# EAGLE design L293D MOTOR SÜRÜCÜ (EAGLE 9.6.2)
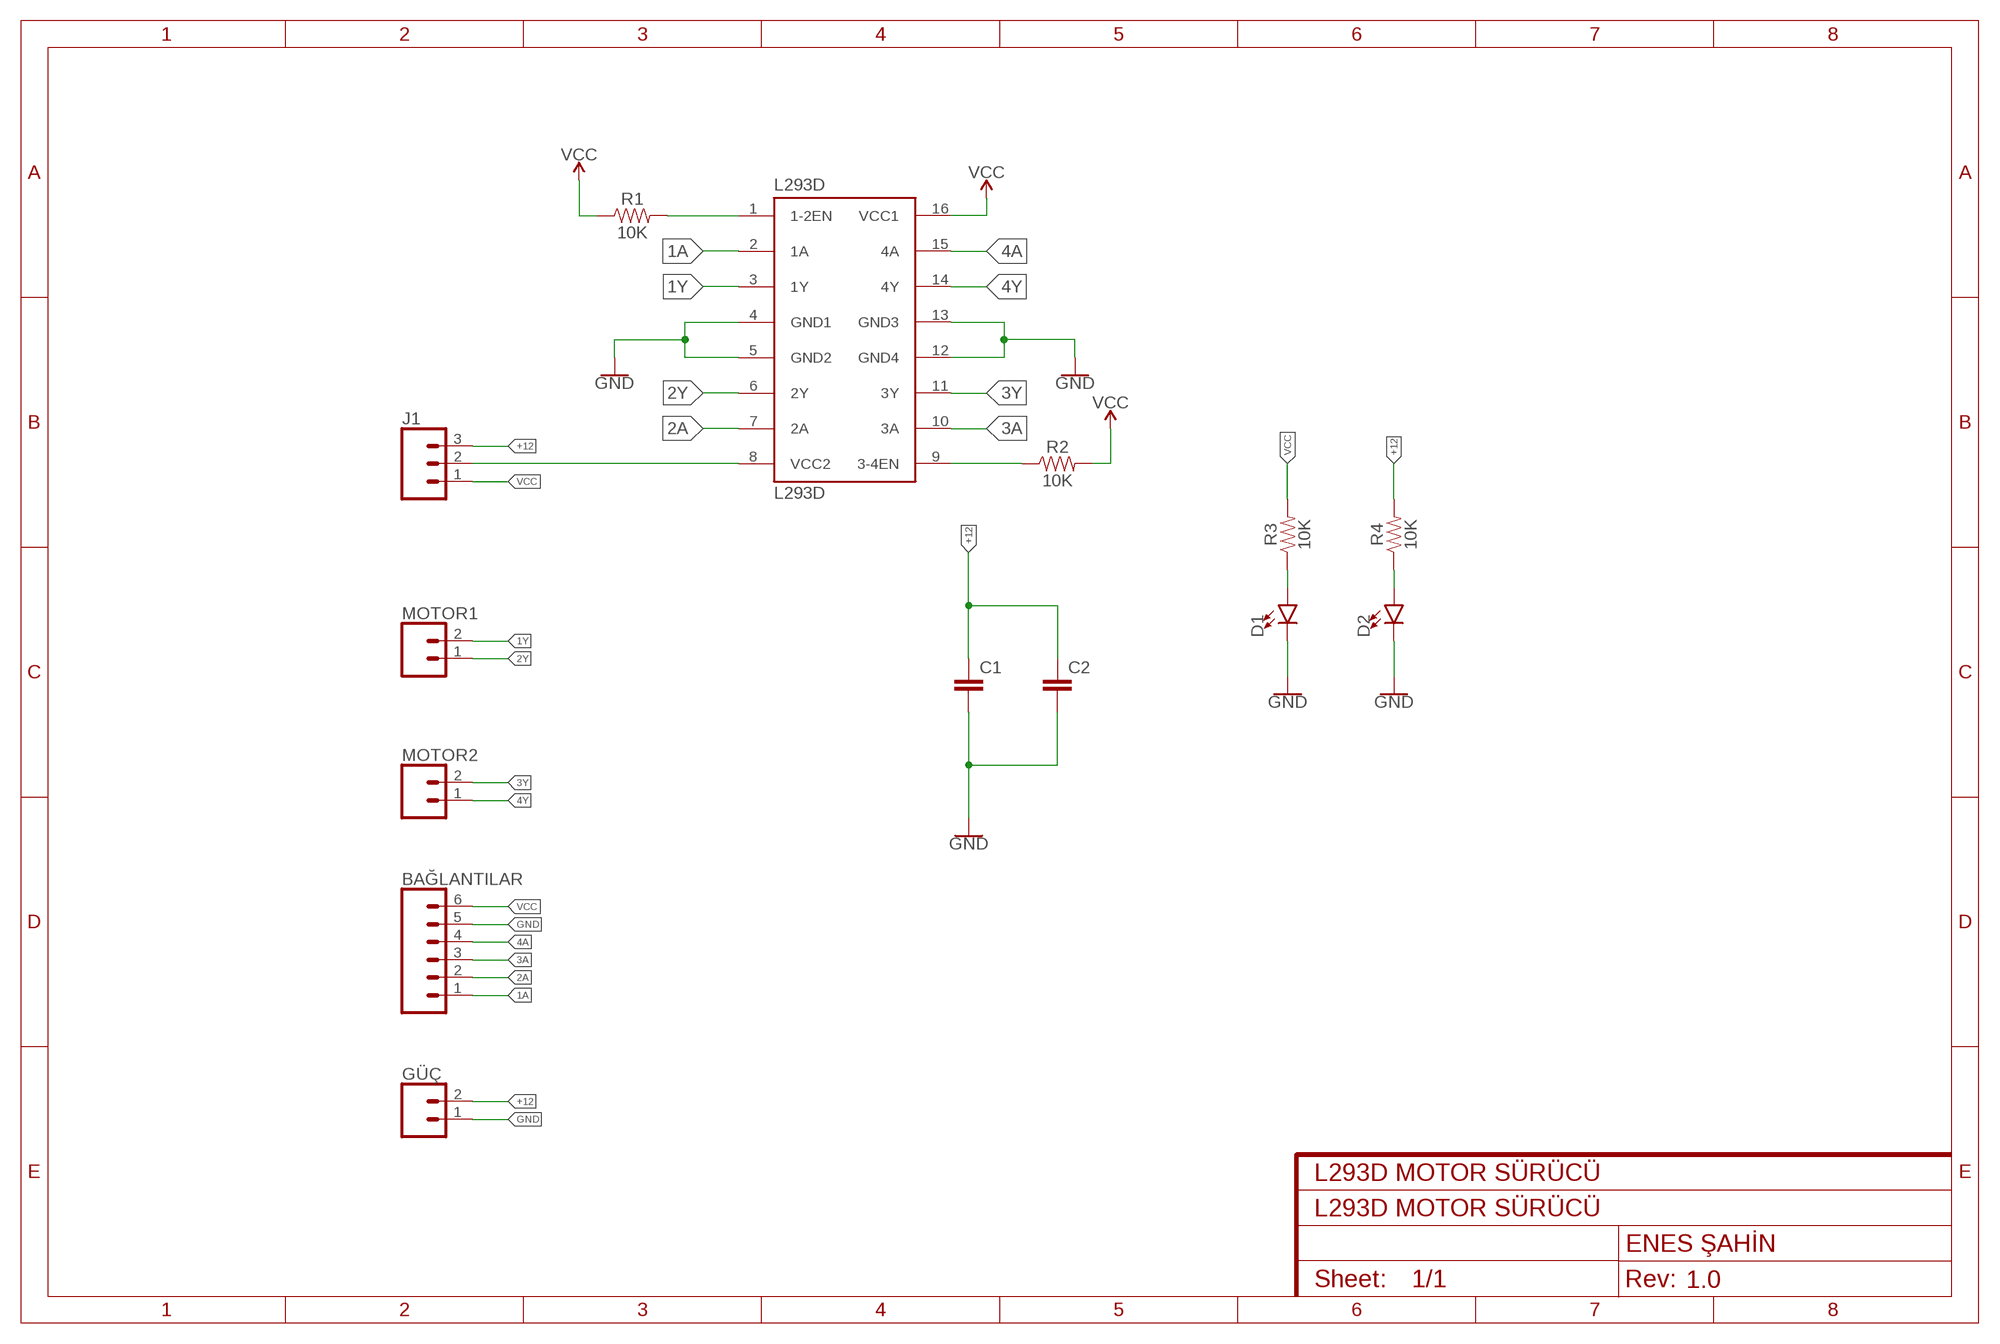
[diagram p0: schematic, sheet 1]
FRAME1 (FRAME-A4L): CNAME: L293D MOTOR SÜRÜCÜ; CREVISION: 1.0; DESIGNER: ENES ŞAHİN

## Parts
BAĞLANTILAR  CONN_06LOCK  [1X06_LOCK]
C1  C2,5-3  [C2.5-3]
C2  C2,5-3  [C2.5-3]
D1  LED-3MM-NO_SILK  [LED_3MM-NS]
D2  LED-3MM-NO_SILK  [LED_3MM-NS]
GÜÇ  CONN_02  [1X02]
J1  CONN_03  [1X03]
L293D  L293D  [DIL16]
MOTOR1  CONN_02  [1X02]
MOTOR2  CONN_02  [1X02]
R1  10K  1KOHM-HORIZ-1/4W-1%  [AXIAL-0.3]
R2  10K  1KOHM-HORIZ-1/4W-1%  [AXIAL-0.3]
R3  10K  1KOHM-HORIZ-1/4W-1%  [AXIAL-0.3]
R4  10K  1KOHM-HORIZ-1/4W-1%  [AXIAL-0.3]

## Nets
1A: BAĞLANTILAR.1 L293D.2(1A)
1Y: L293D.3(1Y) MOTOR1.2
2A: BAĞLANTILAR.2 L293D.7(2A)
2Y: L293D.6(2Y) MOTOR1.1
3A: BAĞLANTILAR.3 L293D.10(3A)
3Y: L293D.11(3Y) MOTOR2.2
4A: BAĞLANTILAR.4 L293D.15(4A)
4Y: L293D.14(4Y) MOTOR2.1
+12: C1.1 C2.1 GÜÇ.2 J1.3 R4.P$2
GND: BAĞLANTILAR.5 C1.2 C2.2 D1.K(C) D2.K(C) GÜÇ.1 L293D.4(GND1) L293D.5(GND2) L293D.12(GND4) L293D.13(GND3)
N$1: J1.2 L293D.8(VCC2)
N$2: D2.A R4.P$1
N$3: L293D.1(1-2EN) R1.P$2
N$4: L293D.9(3-4EN) R2.P$1
N$5: D1.A R3.P$1
VCC: BAĞLANTILAR.6 J1.1 L293D.16(VCC1) R1.P$1 R2.P$2 R3.P$2

## Library data of the parts
BAĞLANTILAR = SparkFun-Connectors:CONN_06: Multi connection point. Often used as Generic Header-pin footprint for 0.1 inch spaced/style header connections On any of the 0.1 inch spaced packages, you can populate with these: Break Away Headers - Straight <https://www.sparkfun.com/products/116> (PRT-00116) Break Away Male Headers - Right Angle <https://www.sparkfun.com/products/553> (PRT-00553) Female Headers <https://www.sparkfun.com/products/115> (PRT-00115) Break Away Headers - Machine Pin <https://www.sparkfun.com/products/117> (PRT-00117) Break Away Female Headers - Swiss Machine Pin <https://www.sparkfun.com/products/743> (PRT-00743) Arduino Stackable Header - 6 Pin <https://www.sparkfun.com/products/9280> (PRT-09280) For SCREWTERMINALS and SPRING TERMINALS visit here: Screw Terimnals on SparkFun.com <https://www.sparkfun.com/search/results?term=Screw+Terminals> (5mm/3.5mm/2.54mm spacing) This device is also useful as a general connection point to wire up your design to another part of your project. Our various solder wires solder well into these plated through hole pads. Hook-Up Wire - Assortment (Stranded, 22 AWG) <https://www.sparkfun.com/products/11375> (PRT-11375) Hook-Up Wire - Assortment (Solid Core, 22 AWG) <https://www.sparkfun.com/products/11367> (PRT-11367) View the entire wire category on our website here <https://www.sparkfun.com/categories/141>
C1 C2 = capacitor-wima:C: CAPACITOR naming: grid - package width
D1 D2 = SparkFun-LED1:LED: LED (Generic) Standard schematic elements and footprints for 5mm, 3mm, 1206, and 0603 sized LEDs. Generic LEDs with no color specified.
GÜÇ MOTOR1 MOTOR2 = SparkFun-Connectors:CONN_02: Multi connection point. Often used as Generic Header-pin footprint for 0.1 inch spaced/style header connections On any of the 0.1 inch spaced packages, you can populate with these: Break Away Headers - Straight <https://www.sparkfun.com/products/116> (PRT-00116) Break Away Male Headers - Right Angle <https://www.sparkfun.com/products/553> (PRT-00553) Female Headers <https://www.sparkfun.com/products/115> (PRT-00115) Break Away Headers - Machine Pin <https://www.sparkfun.com/products/117> (PRT-00117) Break Away Female Headers - Swiss Machine Pin <https://www.sparkfun.com/products/743> (PRT-00743) For SCREWTERMINALS and SPRING TERMINALS visit here: Screw Terimnals on SparkFun.com <https://www.sparkfun.com/search/results?term=Screw+Terminals> (5mm/3.5mm/2.54mm spacing) This device is also useful as a general connection point to wire up your design to another part of your project. Our various solder wires solder well into these plated through hole pads. Hook-Up Wire - Assortment (Stranded, 22 AWG) <https://www.sparkfun.com/products/11375> (PRT-11375) Hook-Up Wire - Assortment (Solid Core, 22 AWG) <https://www.sparkfun.com/products/11367> (PRT-11367) View the entire wire category on our website here <https://www.sparkfun.com/categories/141> Special notes: Molex polarized connector foot print use with: PRT-08233 with associated crimp pins and housings. 2.54_SCREWTERM for use with PRT-10571. 3.5mm Screw Terminal footprints for PRT-08084 5mm Screw Terminal footprints for use with PRT-08432
J1 = SparkFun-Connectors:CONN_03: Multi connection point. Often used as Generic Header-pin footprint for 0.1 inch spaced/style header connections On any of the 0.1 inch spaced packages, you can populate with these: Break Away Headers - Straight <https://www.sparkfun.com/products/116> (PRT-00116) Break Away Male Headers - Right Angle <https://www.sparkfun.com/products/553> (PRT-00553) Female Headers <https://www.sparkfun.com/products/115> (PRT-00115) Break Away Headers - Machine Pin <https://www.sparkfun.com/products/117> (PRT-00117) Break Away Female Headers - Swiss Machine Pin <https://www.sparkfun.com/products/743> (PRT-00743) Stackable Header - 3 Pin (Female, 0.1") <https://www.sparkfun.com/products/13875> (PRT-13875) For SCREWTERMINALS and SPRING TERMINALS visit here: Screw Terimnals on SparkFun.com <https://www.sparkfun.com/search/results?term=Screw+Terminals> (5mm/3.5mm/2.54mm spacing) This device is also useful as a general connection point to wire up your design to another part of your project. Our various solder wires solder well into these plated through hole pads. Hook-Up Wire - Assortment (Stranded, 22 AWG) <https://www.sparkfun.com/products/11375> (PRT-11375) Hook-Up Wire - Assortment (Solid Core, 22 AWG) <https://www.sparkfun.com/products/11367> (PRT-11367) View the entire wire category on our website here <https://www.sparkfun.com/categories/141> Special notes: Molex polarized connector foot print use with SKU : PRT-08232 with associated crimp pins and housings.
L293D = st-microelectronics:L293D: PUSH-PULL 4 CHANNEL DRIVER; MPN: L293D; OC_FARNELL: 9589619; OC_NEWARK: 56P8249
R1-R4 = SparkFun-Resistors:1KOHM: 1kΩ resistor A resistor is a passive two-terminal electrical component that implements electrical resistance as a circuit element. Resistors act to reduce current flow, and, at the same time, act to lower voltage levels within circuits. - Wikipedia; PROD_ID: RES-12182; VALUE: 1k

## Board
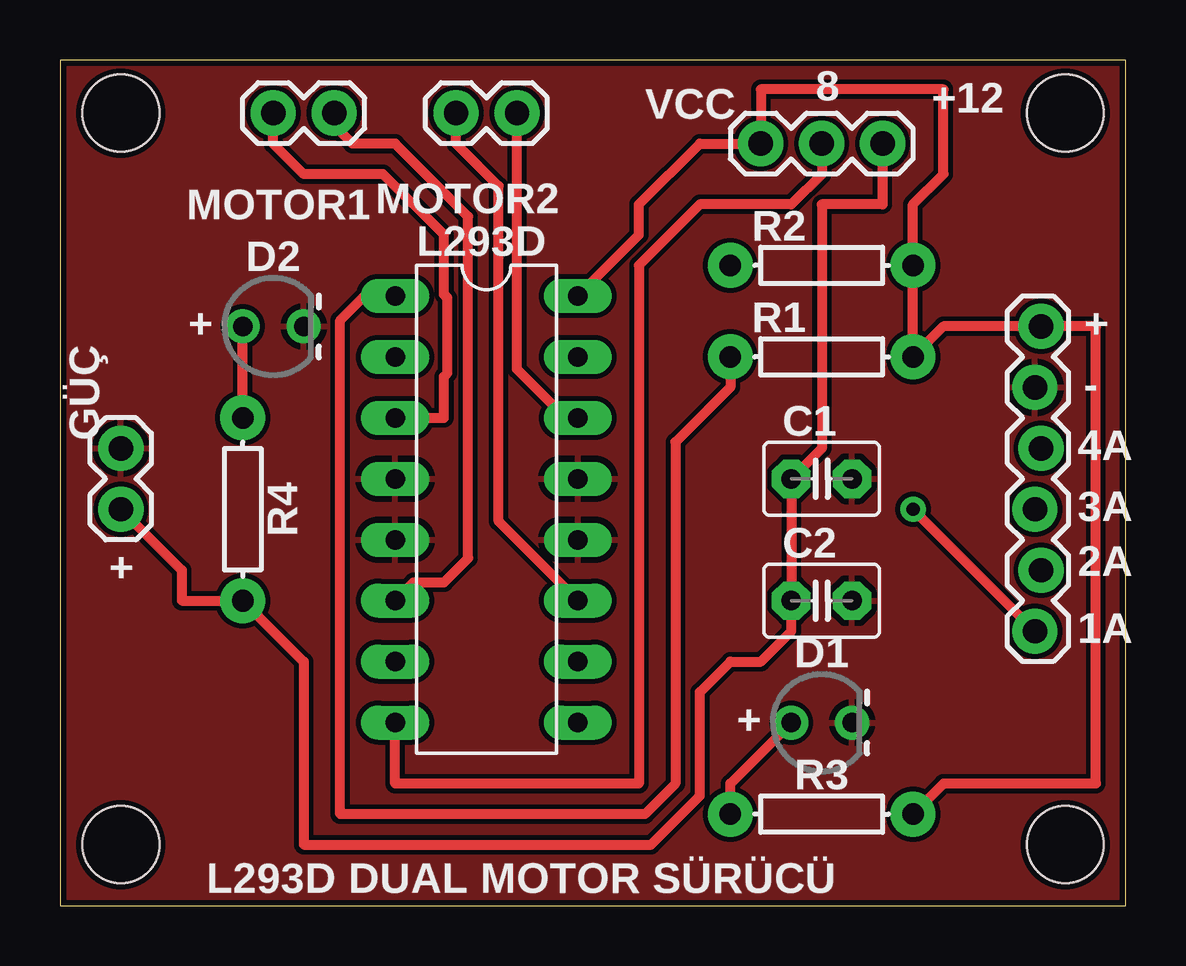
[diagram p1: board, top side]
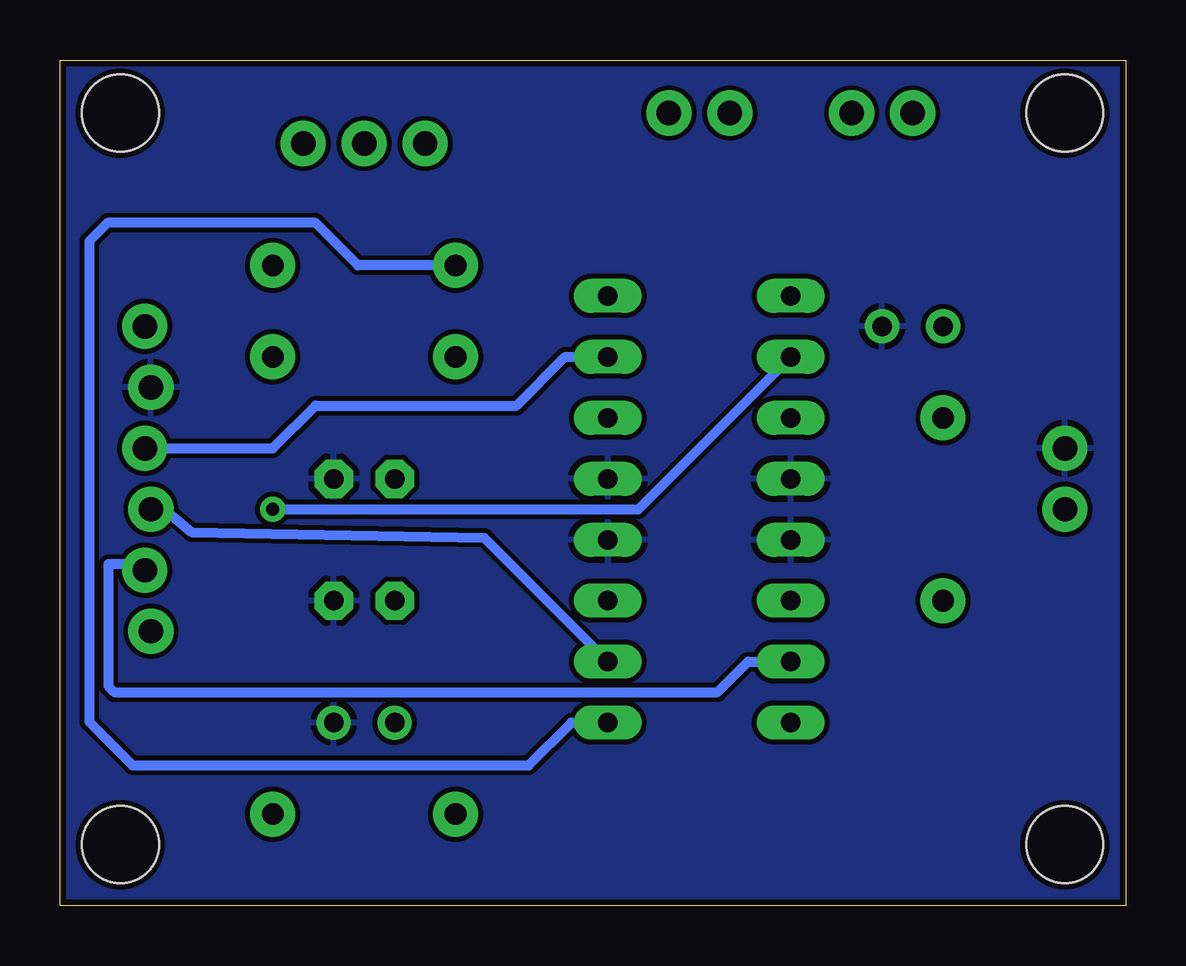
[diagram p2: board, bottom side, seen from below]

Size 44.43 x 35.23 mm. Coordinates in mm from the lower left corner, seen from the top.
Outline: 0,0 44.43,0 44.43,35.23 0,35.23 0,0
Copper layers (1*16): Top 0.035mm / dielectric 1.5mm / Bottom 0.035mm
Design rules "SparkFun": minimum track width 8mil, minimum drill 20mil, track to track 8mil, track to pad 8mil, pad to pad 8mil, via to via 8mil, smd to smd 8mil, copper to edge 10mil, drill to drill 8mil, minimum pad ring 12mil, minimum via ring 10mil, stop-mask expansion 4mil, vias tented up to drill 25mil, thermal gap 10mil
Holes 3.2 mm at 2.54,33.02 41.91,33.02 2.54,2.54 41.91,2.54

### Footprints (pad centres in the part's own frame; a part is rotated, then mirrored left to right if it is on the bottom)
1X06_LOCK = drill 1.016 pad 1.88: 1 0,0; 2 2.54,-0.254; 3 5.08,0; 4 7.62,-0.254; 5 10.16,0; 6 12.7,-0.254
C2.5-3 = drill 0.813 pad 1.6 octagon: 1 -1.27,0; 2 1.27,0
LED_3MM-NS = drill 0.813: A -1.27,0; K 1.27,0
1X02 = drill 1.016 pad 1.88: 1 0,0; 2 2.54,0
1X03 = drill 1.016 pad 1.88: 1 0,0; 2 2.54,0; 3 5.08,0
DIL16 = drill 0.813 long: 1 -8.89,-3.81; 2 -6.35,-3.81; 3 -3.81,-3.81; 4 -1.27,-3.81; 5 1.27,-3.81; 6 3.81,-3.81; 7 6.35,-3.81; 8 8.89,-3.81; 9 8.89,3.81; 10 6.35,3.81; 11 3.81,3.81; 12 1.27,3.81; 13 -1.27,3.81; 14 -3.81,3.81; 15 -6.35,3.81; 16 -8.89,3.81
AXIAL-0.3 = drill 0.9 pad 1.88: P$1 -3.81,0; P$2 3.81,0

### Placement (x,y rotation side)
BAĞLANTILAR  40.64,11.43 90 top
C1  31.75,17.78 0 top
C2  31.75,12.7 0 top
D1  31.75,7.62 0 top
D2  8.89,24.13 0 top
GÜÇ  2.54,19.05 270 top
J1  29.21,31.75 0 top
L293D  17.78,16.51 270 top
MOTOR1  11.43,33.02 180 top
MOTOR2  19.05,33.02 180 top
R1  31.75,22.86 180 top
R2  31.75,26.67 0 top
R3  31.75,3.81 0 top
R4  7.62,16.51 270 top

### Tracks (layer width: path | path; a pad name or v marks a point on that pad's centre or on a via)
1A  (via drill 0.55)
  Top 0.406: BAĞLANTILAR.1 v35.56,16.51
  Bottom 0.406: L293D.2 20.32,16.51 v35.56,16.51
1Y
  Top 0.406: L293D.3 16,20.32 16,22.03 16.15,22.19 16.15,25.31 16,25.47 16,27.94 13.46,30.48 10.16,30.48 8.89,31.75 MOTOR1.2
2A
  Bottom 0.406: BAĞLANTILAR.2 41.15,14.22 42.42,14.22 42.42,9.14 42.16,8.89 17.02,8.89 15.75,10.16 L293D.7
2Y
  Top 0.406: L293D.6 14.73,13.46 16,13.46 17.02,14.48 17.02,28.7 13.97,31.75 12.19,31.75 11.43,32.51 MOTOR1.1
3A
  Bottom 0.406: L293D.10 26.75,15.32 38.94,15.56 40.06,16.51 BAĞLANTILAR.3
3Y
  Top 0.406: L293D.11 18.29,16 18.29,29.97 16.51,31.75 MOTOR2.2
4A
  Bottom 0.406: BAĞLANTILAR.4 35.56,19.05 33.78,20.83 25.4,20.83 23.37,22.86 L293D.15
4Y
  Top 0.406: L293D.14 21.08,20.32 19.05,22.35 MOTOR2.1
+12
  Top 0.406: J1.3 34.29,29.21 31.75,29.21 31.75,19.05 C1.1 C2.1 30.48,11.43 29.21,10.16 27.94,10.16 26.67,8.89 26.67,4.57 24.64,2.54 10.16,2.54 10.16,10.16 R4.P$2 5.08,12.7 5.08,13.97 GÜÇ.2
GND
  pour Top: 5.08,36.83 45.72,36.83 45.72,-1.27 -1.27,-1.27 -1.27,36.83
  pour Bottom: -2.54,38.1 46.99,38.1 46.99,-2.54 -2.54,-2.54
N$1
  Top 0.406: J1.2 31.75,30.48 30.48,29.21 26.67,29.21 24.13,26.67 24.13,5.08 13.97,5.08 L293D.8
N$2
  Top 0.406: R4.P$1 D2.A
N$3
  Top 0.406: R1.P$2 27.94,21.59 25.65,19.3 25.65,5.08 24.38,3.81 11.68,3.81 11.68,24.38 12.7,25.4 L293D.1
N$4
  Bottom 0.406: R2.P$1 32,26.67 33.78,28.45 42.45,28.45 43.21,27.69 43.21,7.65 41.4,5.84 24.89,5.84 23.11,7.62 L293D.9
N$5
  Top 0.406: R3.P$1 27.94,5.08 D1.A
VCC
  Top 0.406: R3.P$2 36.83,5.08 43.18,5.08 43.18,24.13 BAĞLANTILAR.6 36.83,24.13 R1.P$1 R2.P$2 35.56,29.21 36.83,30.48 36.83,34.01 29.21,34.01 J1.1 26.67,31.75 24.13,29.21 24.13,27.94 L293D.16

### Text on the board
tNames: 8 | +12 | VCC | + | + | - | 4A | 3A | + | 2A | 1A | + | L293D DUAL MOTOR SÜRÜCÜ